# Altium schematic sheet gprs.SchDoc
size A4
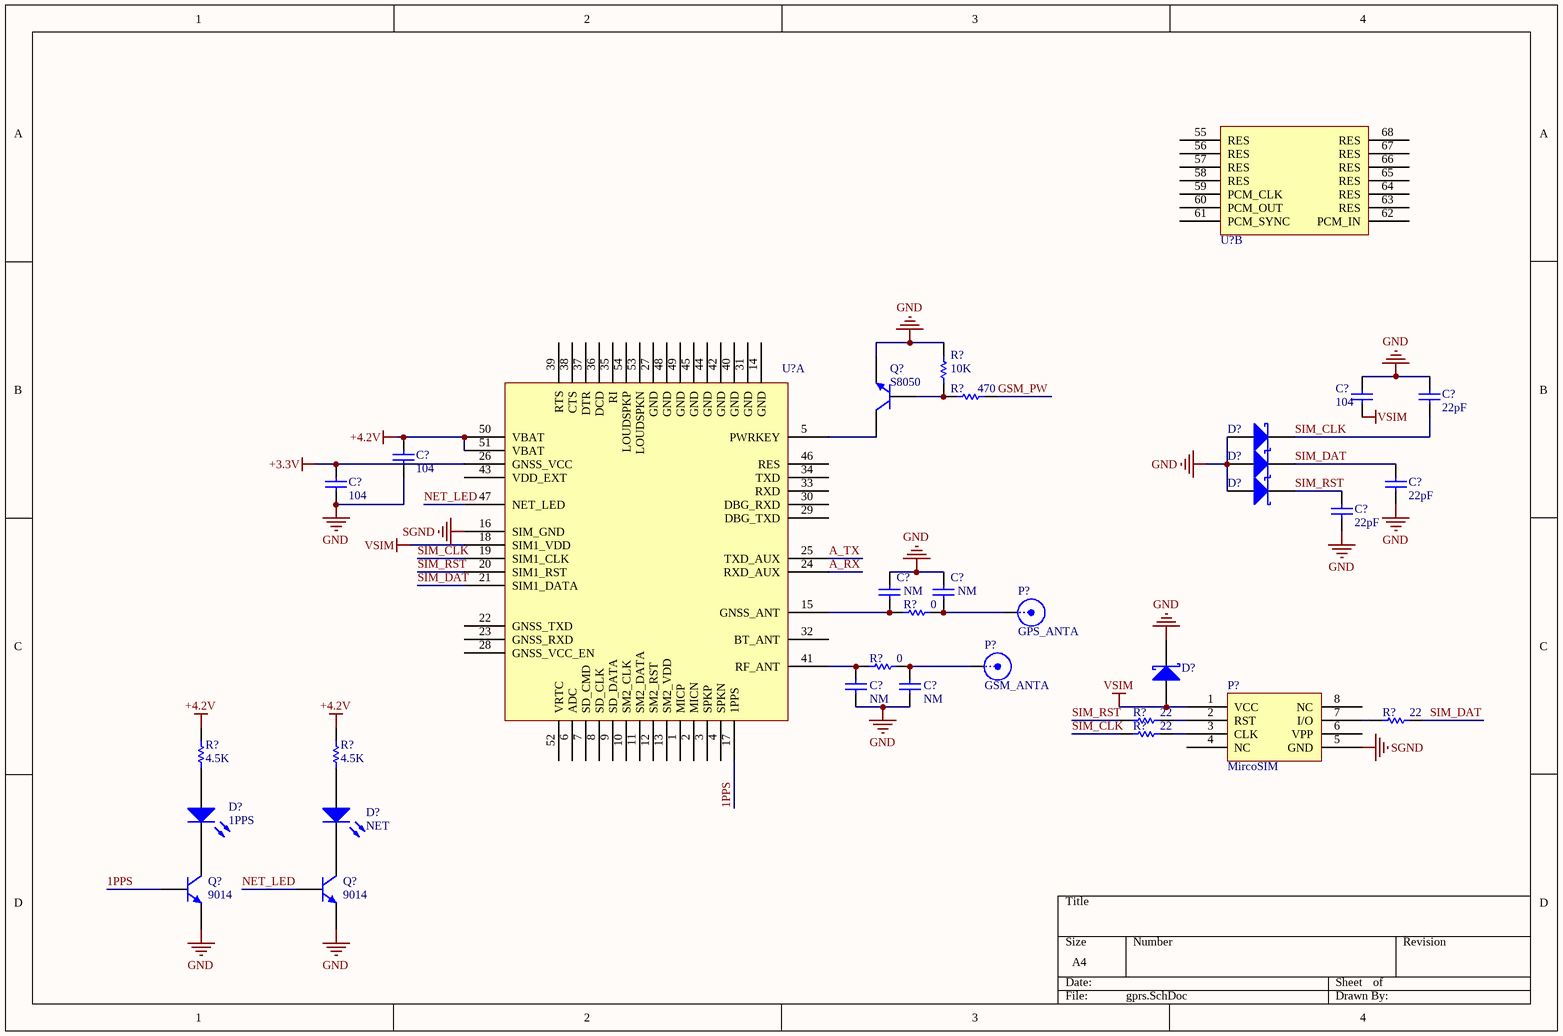
[diagram p0: gprs.SchDoc]

## Parts
(Parts that share a designator on the sheet are numbered #1, #2 ... from top to bottom, then left to right.)
C?#1  value 104  [0603]  (hidden comment: Cap)
C?#2  value 22pF  [0603]  (hidden comment: Cap)
C?#3  value 104  [0603]  (hidden comment: Cap)
C?#4  value 104  [0603]  (hidden comment: Cap)
C?#5  value 22pF  [0603]  (hidden comment: Cap)
C?#6  value 22pF  [0603]  (hidden comment: Cap)
C?#7  value NM  [0603]  (hidden comment: Cap)
C?#8  value NM  [0603]  (hidden comment: Cap)
C?#9  value NM  [0603]  (hidden comment: Cap)
C?#10  value NM  [0603]  (hidden comment: Cap)
D?#1  RL0603E012M100K  [0603]  (value not drawn)
D?#2  RL0603E012M100K  [0603]  (value not drawn)
D?#3  RL0603E012M100K  [0603]  (value not drawn)
D?#4  RL0603E012M100K  [0603]  (value not drawn)
D?#5  1PPS  [0603-LED]
D?#6  NET  [0603-LED]
P?#1  GPS_ANTA  [SMB_V-RJ45]
P?#2  GSM_ANTA  [SMB_V-RJ45]
P?#3  MircoSIM  [Micro SIM]
Q?#1  value S8050  [SOT-23-NPN]  (hidden comment: NPN)
Q?#2  value 9014  [SOT-23-NPN]  (hidden comment: NPN)
Q?#3  value 9014  [SOT-23-NPN]  (hidden comment: NPN)
R?#1  value 10K  [0603]  (hidden comment: Res1)
R?#2  value 470  [0603]  (hidden comment: Res1)
R?#3  value 0  [0603]  (hidden comment: Res1)
R?#4  value 0  [0603]  (hidden comment: Res1)
R?#5  value 22  [0603]  (hidden comment: Res1)
R?#6  value 22  [0603]  (hidden comment: Res1)
R?#7  value 22  [0603]  (hidden comment: Res1)
R?#8  value 4.5K  [0603]  (hidden comment: Res1)
R?#9  value 4.5K  [0603]  (hidden comment: Res1)
U?#1  MC20  [MC20]  (value not drawn)  (part B of 2)
U?#2  MC20  [MC20]  (value not drawn)  (part A of 2)

## Nets
+3.3V: C?#4.1 U?#2.26(GNSS_VCC)
+4.2V: C?#3.1 R?#8.1 R?#9.1 U?#2.50(VBAT) U?#2.51(VBAT)
GND: C?#1.1 C?#2.1 C?#3.2 C?#4.2 C?#5.2 C?#6.2 C?#7.1 C?#8.2 C?#9.2 C?#10.2 D?#1.2(A) D?#2.2(A) D?#3.2(A) D?#4.1(K) P?#1.2(Y) P?#2.2(Y) Q?#1.1(E) Q?#2.1(E) Q?#3.1(E) R?#1.2
SGND: P?#3.5(GND) U?#2.16(SIM_GND)
VSIM: C?#1.2 D?#4.2(A) P?#3.1(VCC) U?#2.18(SIM1_VDD)
1PPS: Q?#2.2(B) U?#2.17(1PPS)
A_RX: U?#2.24(RXD_AUX)
A_TX: U?#2.25(TXD_AUX)
GSM_PW: R?#2.2
NET_LED: Q?#3.2(B) U?#2.47(NET_LED)
SIM_CLK: C?#2.2 D?#1.1(K) R?#7.1 U?#2.19(SIM1_CLK)
SIM_DAT: C?#5.1 D?#2.1(K) R?#6.2 U?#2.21(SIM1_DATA)
SIM_RST: C?#6.1 D?#3.1(K) R?#5.1 U?#2.20(SIM1_RST)
NetC?#7_2: C?#7.2 P?#1.1(X) R?#3.2
NetC?#8_1: C?#8.1 R?#3.1 U?#2.15(GNSS_ANT)
NetC?#9_1: C?#9.1 R?#4.1 U?#2.41(RF_ANT)
NetC?#10_1: C?#10.1 P?#2.1(X) R?#4.2
NetD?#5_1: D?#5.1(A) R?#8.2
NetD?#5_2: D?#5.2(K) Q?#2.3(C)
NetD?#6_1: D?#6.1(A) R?#9.2
NetD?#6_2: D?#6.2(K) Q?#3.3(C)
NetP?#3_2: P?#3.2(RST) R?#5.2
NetP?#3_3: P?#3.3(CLK) R?#7.2
NetP?#3_7: P?#3.7(I/O) R?#6.1
NetQ?#1_2: Q?#1.2(B) R?#1.1 R?#2.1
NetQ?#1_3: Q?#1.3(C) U?#2.5(PWRKEY)

Not connected (* = marked no-connect by the designer): P?#3 4(NC) 6(VPP) 8(NC); U?#1 55(RES) 56(RES) 57(RES) 58(RES) 59(PCM_CLK) 60(PCM_OUT) 61(PCM_SYNC) 62(PCM_IN) 63(RES) 64(RES) 65(RES) 66(RES) 67(RES) 68(RES); U?#2 1(MICP) 2(MICN) 3(SPKP) 4(SPKN) 6(ADC) 7(SD_CMD) 8(SD_CLK) 9(SD_DATA) 10(SM2_CLK) 11(SM2_DATA) 12(SM2_RST) 13(SM2_VDD) 14(GND) 22(GNSS_TXD) 23(GNSS_RXD) 27(GND) 28(GNSS_VCC_EN) 29(DBG_TXD) 30(DBG_RXD) 31(GND) 32(BT_ANT) 33(RXD) 34(TXD) 35(RI) 36(DCD) 37(DTR) 38(CTS) 39(RTS) 40(GND) 42(GND) 43(VDD_EXT) 44(GND) 45(GND) 46(RES) 48(GND) 49(GND) 52(VRTC) 53(LOUDSPKN) 54(LOUDSPKP)

## Library data of the parts
C?#1-C?#10 = Cap: Capacitor; Published: 8-Jun-2000; LatestRevisionDate: 17-Jul-2002; LatestRevisionNote: Re-released for DXP Platform.; PackageReference: RAD-0.3; Publisher: Altium Limited
D?#1-D?#4 = Diode 18TQ045: Schottky Rectifier; Note: Terminal 2 is the TAB and is electrically connected to the cathode; Value: SMBJ45CA; Published: 8-Jun-2000; LatestRevisionDate: 17-Jul-2002; LatestRevisionNote: Re-released for DXP Platform.; DatasheetDocument: Dec-1997; PackageDocument: Feb-1998; PackageReference: TO-220AC; Publisher: Altium Limited; ComponentLink1Description: Manufacturer Link; ComponentLink1URL: http://www.irf.com/; ComponentLink2Description: Datasheet; ComponentLink2URL: http://www.irf.com/product-info/datasheets/data/18tq.pdf
D?#5 D?#6 = LED2: Typical RED, GREEN, YELLOW, AMBER GaAs LED; Value: GRN; Published: 8-Jun-2000; LatestRevisionDate: 17-Jul-2002; LatestRevisionNote: Re-released for DXP Platform.; PackageDocument: Feb-2002; PackageReference: 3.2X1.6X1.1; Publisher: Altium Limited
P?#1 P?#2 = SMB: SMB Straight Connector; LatestRevisionDate: 17-Jul-2002; LatestRevisionNote: Re-released for DXP Platform.; Publisher: Altium Limited
Q?#1-Q?#3 = 2N5551: NPN General Purpose Amplifier; Published: 8-Jun-2000; LatestRevisionDate: 17-Jan-2003; LatestRevisionNote: PCB Footprint 'BCY-W3/D4.7' replaced; DatasheetDocument: 1997; PackageDocument: Sep-1998; PackageReference: TO-92A; Publisher: Altium Limited; ComponentLink1Description: Manufacturer Link; ComponentLink1URL: http://www.fairchildsemi.com/; ComponentLink2Description: Datasheet; ComponentLink2URL: http://www.fairchildsemi.com/ds/2N%2F2N5551.pdf
R?#1-R?#9 = Res1: Resistor; Published: 8-Jun-2000; LatestRevisionDate: 17-Jul-2002; LatestRevisionNote: Re-released for DXP Platform.; PackageReference: AXIAL-0.3; Publisher: Altium Limited